# EAGLE design lego (EAGLE 5.06)
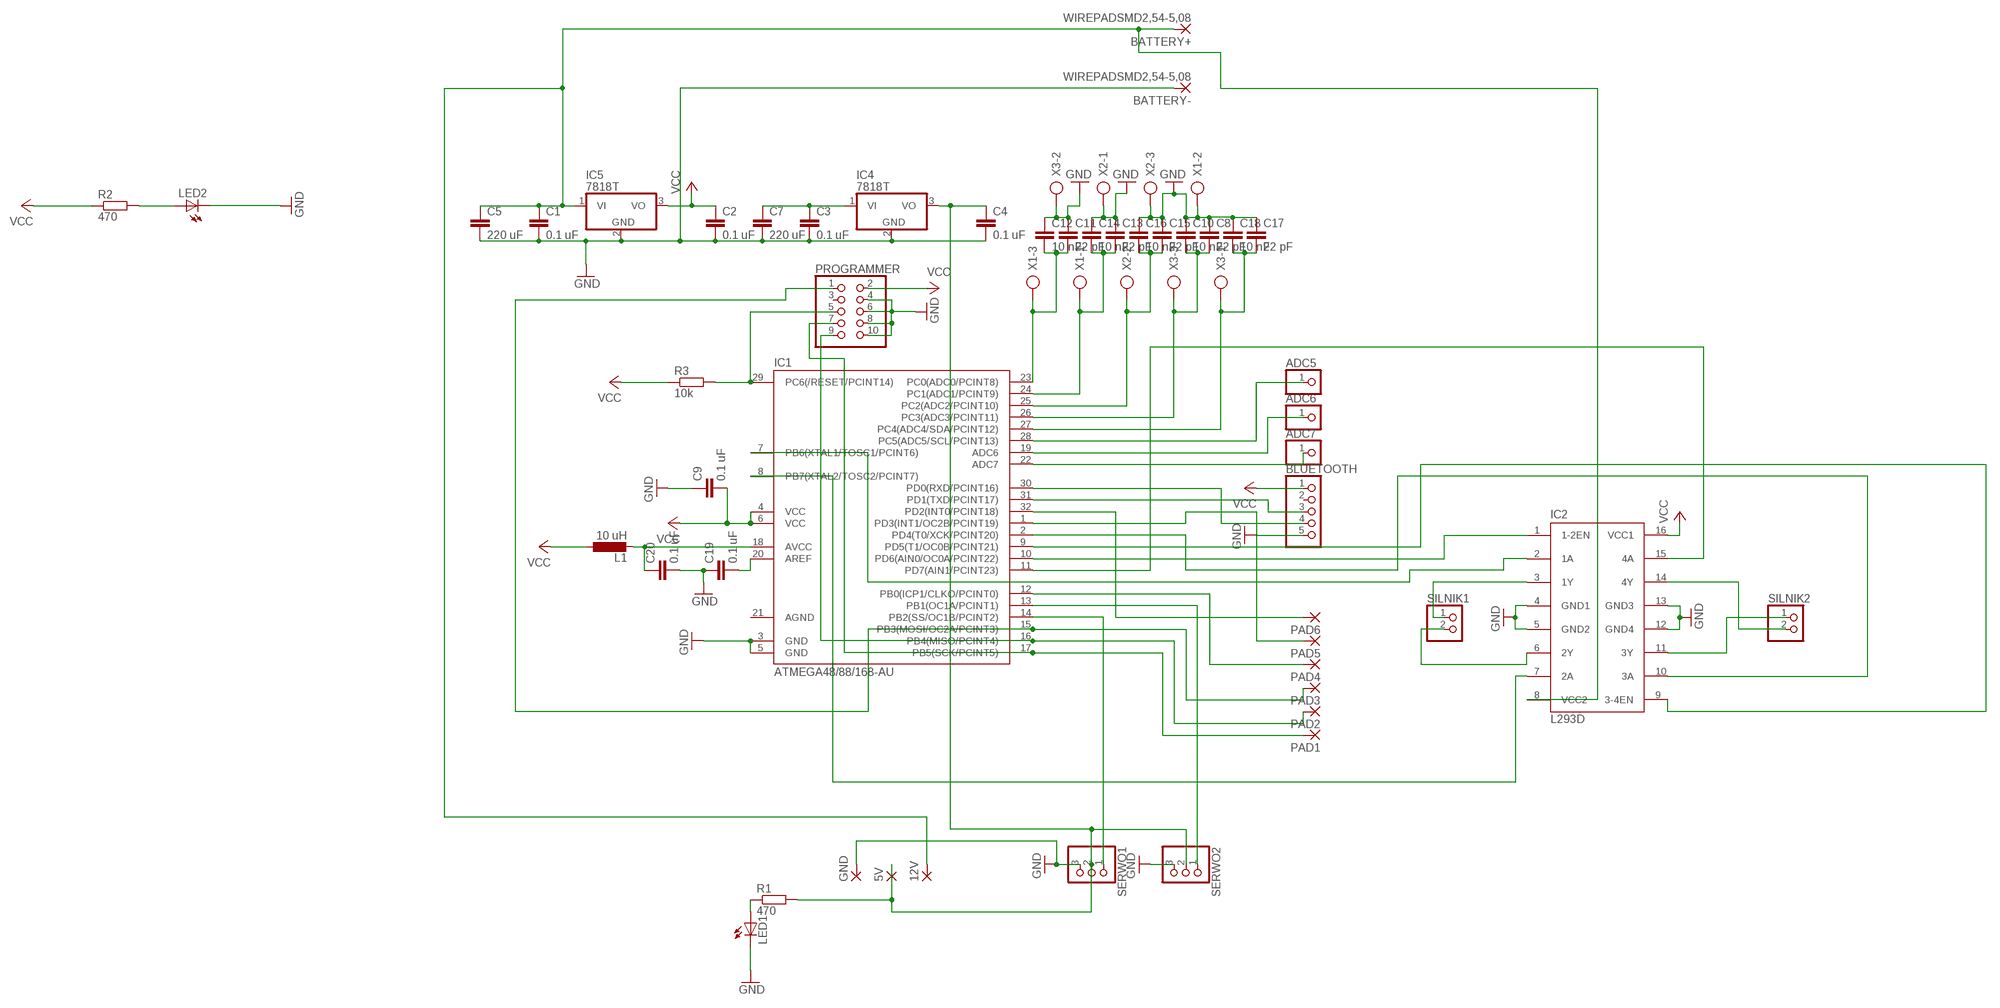
[diagram p0: schematic, sheet 1]

## Parts
5V  SMD2  [SMD1,27-2,54]
12V  SMD2  [SMD1,27-2,54]
ADC5  PINHD-1X1  [1X01]
ADC6  PINHD-1X1  [1X01]
ADC7  PINHD-1X1  [1X01]
BATTERY+  WIREPADSMD2,54-5,08  [SMD2,54-5,08]
BATTERY-  WIREPADSMD2,54-5,08  [SMD2,54-5,08]
BLUETOOTH  PINHD-1X5  [1X05]
C1  0.1 uF  C-EUC0805  [C0805]
C2  0.1 uF  C-EUC0805  [C0805]
C3  0.1 uF  C-EUC0805  [C0805]
C4  0.1 uF  C-EUC0805  [C0805]
C5  220 uF  C-EU025-050X050  [C025-050X050]
C7  220 uF  C-EU025-050X050  [C025-050X050]
C8  22 pF  C-EUC0805  [C0805]
C9  0.1 uF  C-EUC0805  [C0805]
C10  10 nF  C-EUC0805  [C0805]
C11  22 pF  C-EUC0805  [C0805]
C12  10 nF  C-EUC0805  [C0805]
C13  22 pF  C-EUC0805  [C0805]
C14  10 nF  C-EUC0805  [C0805]
C15  22 pF  C-EUC0805  [C0805]
C16  10 nF  C-EUC0805  [C0805]
C17  22 pF  C-EUC0805  [C0805]
C18  10 nF  C-EUC0805  [C0805]
C19  0.1 uF  C-EUC0805  [C0805]
C20  0.1 uF  C-EUC0805  [C0805]
GND  SMD2  [SMD1,27-2,54]
IC1  ATMEGA48/88/168-AU  [TQFP32-08]
IC2  L293D  [DIL16]
IC4  7818T  [TO220H]
IC5  7818T  [TO220H]
L1  10 uH  L-EU0207/7  [0207/7]
LED1  LED3MM  [LED3MM]
LED2  LED3MM  [LED3MM]
PAD1  SMD2  [SMD1,27-2,54]
PAD2  SMD2  [SMD1,27-2,54]
PAD3  SMD2  [SMD1,27-2,54]
PAD4  SMD2  [SMD1,27-2,54]
PAD5  SMD2  [SMD1,27-2,54]
PAD6  SMD2  [SMD1,27-2,54]
PROGRAMMER  PINHD-2X5  [2X05]
R1  470  R-EU_M0805  [M0805]
R2  470  R-EU_M0805  [M0805]
R3  10k  R-EU_M0805  [M0805]
SERWO1  PINHD-1X3  [1X03]
SERWO2  PINHD-1X3  [1X03]
SILNIK1  PINHD-1X2  [1X02]
SILNIK2  PINHD-1X2  [1X02]
X1  AK500/3  [AK500/3]
X2  AK500/3  [AK500/3]
X3  AK500/3  [AK500/3]

## Nets
GND: BATTERY-.1(P) BLUETOOTH.5 C1.2 C2.2 C3.2 C4.2 C5.2 C7.2 C8.1 C9.1 C10.1 C11.1 C12.1 C13.1 C14.1 C15.1 C16.1 C17.1 C18.1 C19.1 C20.2 GND.1(P) IC1.3(GND) IC1.5(GND) IC2.4(GND1) IC2.5(GND2) IC2.12(GND4) IC2.13(GND3) IC4.2(GND) IC5.2(GND) LED1.K(C) LED2.K(C) PROGRAMMER.4 PROGRAMMER.6 PROGRAMMER.8 PROGRAMMER.10 SERWO1.3 SERWO2.3 X1.2 X2.1 X2.3 X3.2
N$1: IC1.29(PC6(/RESET/PCINT14)) PROGRAMMER.5 R3.2
N$2: 12V.1(P) BATTERY+.1(P) C1.1 C5.1 IC2.8(VCC2) IC5.1(VI)
N$3: IC1.15(PB3(MOSI/OC2A/PCINT3)) PAD3.1(P) PROGRAMMER.1
N$4: C19.2 IC1.20(AREF)
N$5: C3.1 C7.1 IC4.1(VI)
N$6: C20.1 IC1.18(AVCC) L1.2
N$7: IC1.16(PB4(MISO/PCINT4)) PAD2.1(P) PROGRAMMER.9
N$8: IC1.17(PB5(SCK/PCINT5)) PAD1.1(P) PROGRAMMER.7
N$9: C11.2 C12.2 IC1.23(PC0(ADC0/PCINT8)) X1.3
N$10: C13.2 C14.2 IC1.24(PC1(ADC1/PCINT9)) X1.1
N$11: C15.2 C16.2 IC1.25(PC2(ADC2/PCINT10)) X2.2
N$12: C8.2 C10.2 IC1.26(PC3(ADC3/PCINT11)) X3.3
N$13: C17.2 C18.2 IC1.27(PC4(ADC4/SDA/PCINT12)) X3.1
N$14: ADC5.1 IC1.28(PC5(ADC5/SCL/PCINT13))
N$15: ADC6.1 IC1.19(ADC6)
N$16: ADC7.1 IC1.22(ADC7)
N$17: IC2.3(1Y) SILNIK1.1
N$18: IC2.11(3Y) SILNIK2.1
N$19: IC2.6(2Y) SILNIK1.2
N$20: IC2.14(4Y) SILNIK2.2
N$21: LED2.A R2.2
N$22: LED1.A R1.1
N$23: BLUETOOTH.4 IC1.30(PD0(RXD/PCINT16))
N$24: BLUETOOTH.3 IC1.31(PD1(TXD/PCINT17))
N$25: IC1.10(PD6(AIN0/OC0A/PCINT22)) IC2.1(1-2EN)
N$26: IC1.9(PD5(T1/OC0B/PCINT21)) IC2.9(3-4EN)
N$27: IC1.7(PB6(XTAL1/TOSC1/PCINT6)) IC2.2(1A)
N$28: IC1.8(PB7(XTAL2/TOSC2/PCINT7)) IC2.7(2A)
N$29: IC1.2(PD4(T0/XCK/PCINT20)) IC2.10(3A)
N$30: IC1.11(PD7(AIN1/PCINT23)) IC2.15(4A)
N$31: IC1.13(PB1(OC1A/PCINT1)) SERWO2.1
N$32: IC1.14(PB2(SS/OC1B/PCINT2)) SERWO1.1
N$33: 5V.1(P) C4.1 IC4.3(VO) R1.2 SERWO1.2 SERWO2.2
N$34: IC1.12(PB0(ICP1/CLKO/PCINT0)) PAD4.1(P)
N$35: IC1.1(PD3(INT1/OC2B/PCINT19)) PAD5.1(P)
N$36: IC1.32(PD2(INT0/PCINT18)) PAD6.1(P)
VCC: BLUETOOTH.1 C2.1 C9.2 IC1.4(VCC) IC1.6(VCC) IC2.16(VCC1) IC5.3(VO) L1.1 PROGRAMMER.2 R2.1 R3.1
Unconnected: BLUETOOTH.2 PROGRAMMER.3

## Power pins joined to a net without a drawn wire
AGND: IC1.21(AGND)

## Library data of the parts
5V 12V GND PAD1-PAD6 = wirepad:SMD2: SMD PAD
ADC5-ADC7 = pinhead:PINHD-1X1: PIN HEADER
BATTERY+ BATTERY- = wirepad:WIREPAD: Wire PAD connect wire on PCB
BLUETOOTH = pinhead:PINHD-1X5: PIN HEADER
C1-C5 C7-C20 = rcl:C-EU: CAPACITOR, European symbol
IC1 = atmega8:ATMEGA48/88/168
IC2 = st-microelectronics:L293D: PUSH-PULL 4 CHANNEL DRIVER
IC4 IC5 = linear:78*: Positive VOLTAGE REGULATOR Source: http://cache.national.com/ds/LM/LM78L05.pdf http://www.fairchildsemi.com/ds/LM/LM7805.pdf
L1 = rcl:L-EU: INDUCTOR, European symbol
LED1 LED2 = led:LED: LED OSRAM: - CHIPLED LG R971, LG N971, LY N971, LG Q971, LY Q971, LO R971, LY R971 LH N974, LH R974 LS Q976, LO Q976, LY Q976 LO Q996 - Hyper CHIPLED LW Q18S LB Q993, LB Q99A, LB R99A - SideLED LS A670, LO A670, LY A670, LG A670, LP A670 LB A673, LV A673, LT A673, LW A673 LH A674 LY A675 LS A676, LA A676, LO A676, LY A676, LW A676 LS A679, LY A679, LG A679 - Hyper Micro SIDELED® LS Y876, LA Y876, LO Y876, LY Y876 LT Y87S - SmartLED LW L88C, LW L88S LB L89C, LB L89S, LG L890 LS L89K, LO L89K, LY L89K LS L896, LA L896, LO L896, LY L896 - TOPLED LS T670, LO T670, LY T670, LG T670, LP T670 LSG T670, LSP T670, LSY T670, LOP T670, LYG T670 LG T671, LOG T671, LSG T671 LB T673, LV T673, LT T673, LW T673 LH T674 LS T676, LA T676, LO T676, LY T676, LB T676, LH T676, LSB T676, LW T676 LB T67C, LV T67C, LT T67C, LS T67K, LO T67K, LY T67K, LW E67C LS E67B, LA E67B, LO E67B, LY E67B, LB E67C, LV E67C, LT E67C LW T67C LS T679, LY T679, LG T679 LS T770, LO T770, LY T770, LG T770, LP T770 LB T773, LV T773, LT T773, LW T773 LH T774 LS E675, LA E675, LY E675, LS T675 LS T776, LA T776, LO T776, LY T776, LB T776 LHGB T686 LT T68C, LB T68C - Hyper Mini TOPLED® LB M676 - Mini TOPLED Santana® LG M470 LS M47K, LO M47K, LY M47K Source: http://www.osram.convergy.de LUXEON: - LUMILED® LXK2-PW12-R00, LXK2-PW12-S00, LXK2-PW14-U00, LXK2-PW14-V00 LXK2-PM12-R00, LXK2-PM12-S00, LXK2-PM14-U00 LXK2-PE12-Q00, LXK2-PE12-R00, LXK2-PE12-S00, LXK2-PE14-T00, LXK2-PE14-U00 LXK2-PB12-K00, LXK2-PB12-L00, LXK2-PB12-M00, LXK2-PB14-N00, LXK2-PB14-P00, LXK2-PB14-Q00 LXK2-PR12-L00, LXK2-PR12-M00, LXK2-PR14-Q00, LXK2-PR14-R00 LXK2-PD12-Q00, LXK2-PD12-R00, LXK2-PD12-S00 LXK2-PH12-R00, LXK2-PH12-S00 LXK2-PL12-P00, LXK2-PL12-Q00, LXK2-PL12-R00 Source: www.luxeon.com KINGBRIGHT: KA-3528ASYC Source: www.kingbright.com
PROGRAMMER = pinhead:PINHD-2X5: PIN HEADER
R1-R3 = rcl:R-EU_: RESISTOR, European symbol
SERWO1 SERWO2 = pinhead:PINHD-1X3: PIN HEADER
SILNIK1 SILNIK2 = pinhead:PINHD-1X2: PIN HEADER
X1-X3 = con-ptr500:AK500/3: CONNECTOR

## Board
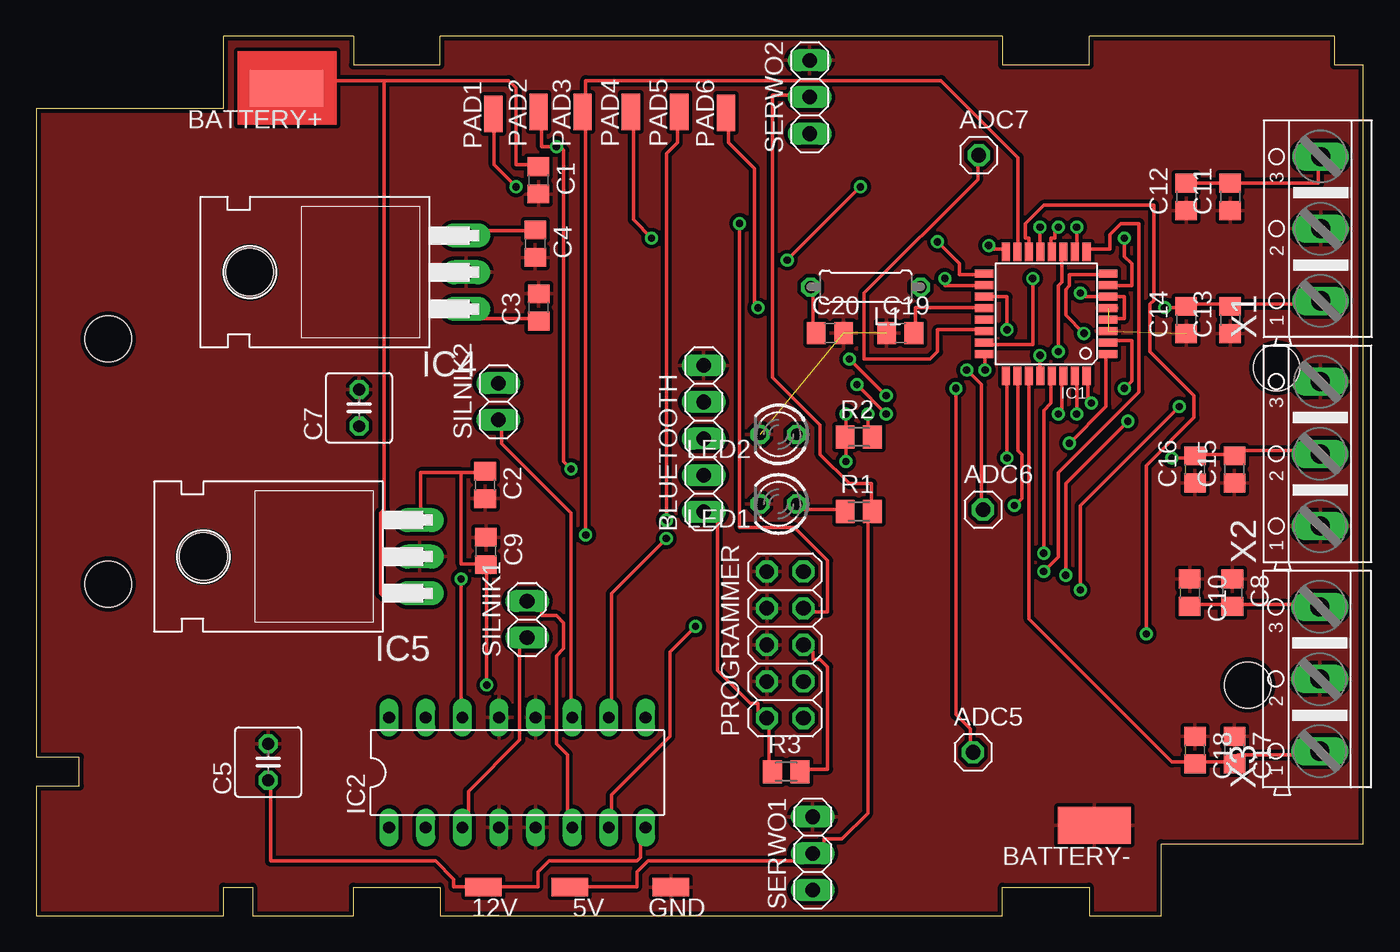
[diagram p1: board, top side]
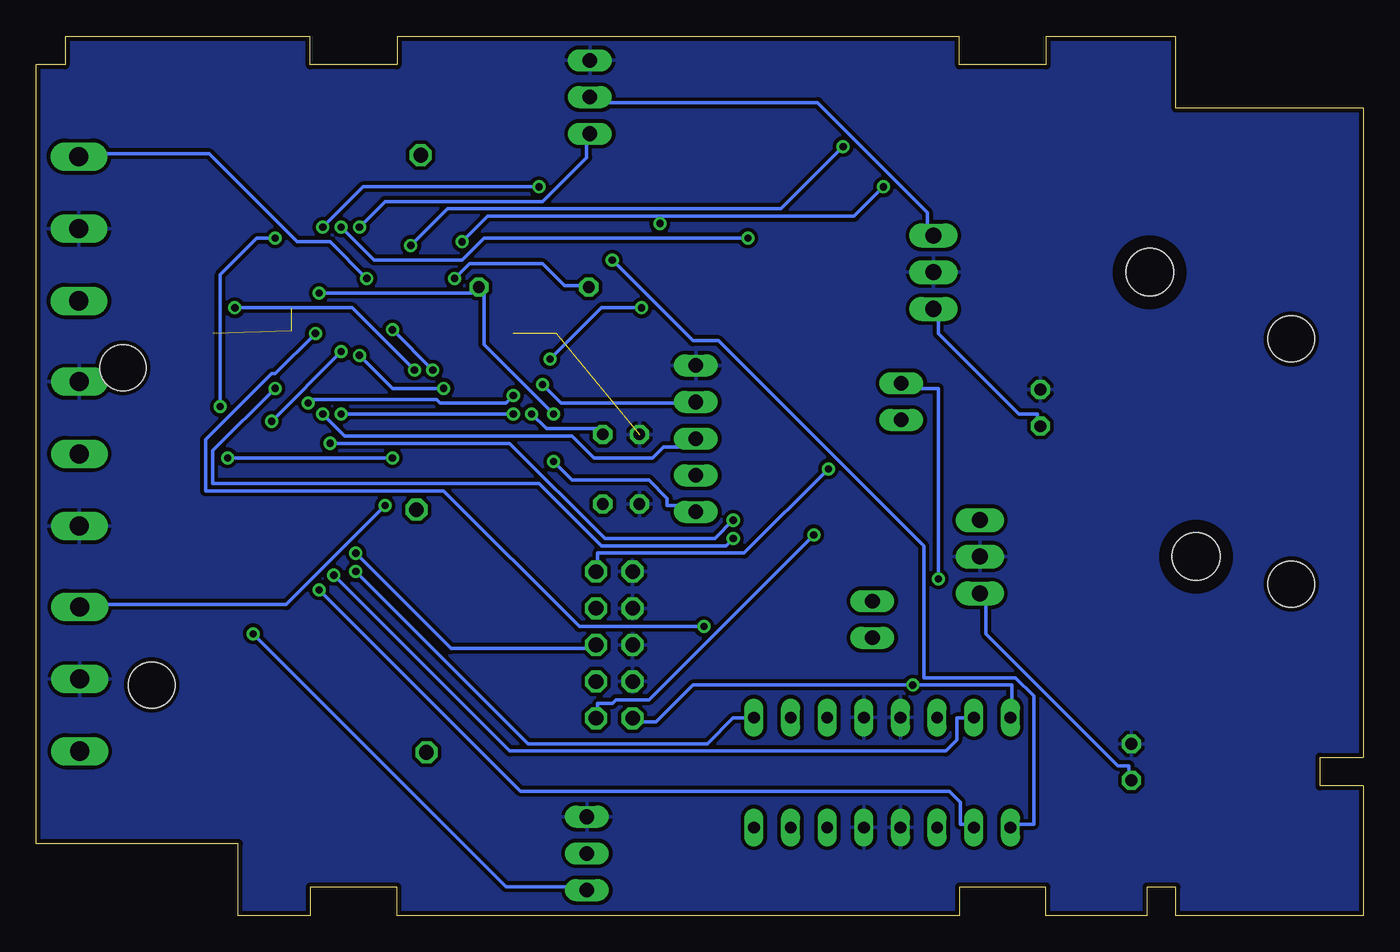
[diagram p2: board, bottom side, seen from below]

Size 92 x 61 mm. Coordinates in mm from the lower left corner, seen from the top.
Outline: 0,0 13,0 13,2 15,2 15,0 22,0 22,2 28,2 28,0 67,0 67,2 73,2 73,0 78,0 78,5 92,5 92,59 90,59 90,61 73,61 73,59 67,59 67,61 28,61 28,59 22,59 22,61 13,61 13,56 0,56 0,11 3,11 3,9 0,9 0,0
Copper layers (1*16): Top 0.035mm / dielectric 1.5mm / Bottom 0.035mm
Design rules "default *": minimum track width 10mil, minimum drill 0.5mm, track to track 10mil, track to pad 10mil, pad to pad 10mil, via to via 10mil, smd to smd 10mil, copper to edge 12mil, drill to drill 8mil, minimum pad ring 10mil, minimum via ring 8mil, stop-mask expansion 4mil, vias tented up to drill 0mil, thermal gap 10mil
Holes 3.2 mm at 5,23 5,40 84,16 86,38

### Footprints (pad centres in the part's own frame; a part is rotated, then mirrored left to right if it is on the bottom)
SMD1,27-2,54 = smd 1.27 x 2.54: 1 0,0
1X01 = drill 1.016 octagon: 1 0,0
SMD2,54-5,08 = smd 2.54 x 5.08: 1 0,0
1X05 = drill 1.016 long: 1 -5.08,0; 2 -2.54,0; 3 0,0; 4 2.54,0; 5 5.08,0
C0805 = smd 1.3 x 1.5: 1 -0.95,0; 2 0.95,0
C025-050X050 = drill 0.813 octagon: 1 -1.27,0; 2 1.27,0
TQFP32-08 = smd 1.27 x 0.559: 1 -4.293,2.8; 2 -4.293,2; 3 -4.293,1.2; 4 -4.293,0.4; 5 -4.293,-0.4; 6 -4.293,-1.2; 7 -4.293,-2; 8 -4.293,-2.8; 17 4.293,-2.8; 18 4.293,-2; 19 4.293,-1.2; 20 4.293,-0.4; 21 4.293,0.4; 22 4.293,1.2; 23 4.293,2; 24 4.293,2.8 | smd 0.559 x 1.27: 9 -2.8,-4.293; 10 -2,-4.293; 11 -1.2,-4.293; 12 -0.4,-4.293; 13 0.4,-4.293; 14 1.2,-4.293; 15 2,-4.293; 16 2.8,-4.293; 25 2.8,4.293; 26 2,4.293; 27 1.2,4.293; 28 0.4,4.293; 29 -0.4,4.293; 30 -1.2,4.293; 31 -2,4.293; 32 -2.8,4.293
DIL16 = drill 0.813 long: 1 -8.89,-3.81; 2 -6.35,-3.81; 3 -3.81,-3.81; 4 -1.27,-3.81; 5 1.27,-3.81; 6 3.81,-3.81; 7 6.35,-3.81; 8 8.89,-3.81; 9 8.89,3.81; 10 6.35,3.81; 11 3.81,3.81; 12 1.27,3.81; 13 -1.27,3.81; 14 -3.81,3.81; 15 -6.35,3.81; 16 -8.89,3.81
TO220H = drill 1.118 long: 1 -2.54,-10.16; 2 0,-10.16; 3 2.54,-10.16 | hole 3.302: 0,4.826
0207/7 = drill 0.813 octagon: 1 -3.81,0; 2 3.81,0
LED3MM = drill 0.813 octagon: A -1.27,0; K 1.27,0
2X05 = drill 1.016 octagon: 1 -5.08,-1.27; 2 -5.08,1.27; 3 -2.54,-1.27; 4 -2.54,1.27; 5 0,-1.27; 6 0,1.27; 7 2.54,-1.27; 8 2.54,1.27; 9 5.08,-1.27; 10 5.08,1.27
M0805 = smd 1.3 x 1.6: 1 -0.95,0; 2 0.95,0
1X03 = drill 1.016 long: 1 -2.54,0; 2 0,0; 3 2.54,0
1X02 = drill 1.016 long: 1 -1.27,0; 2 1.27,0
AK500/3 = drill 1.321 long: 1 -5.004,0; 2 0,0; 3 5.004,0

### Placement (x,y rotation side)
5V  37,2 90 top
12V  31,2 90 top
ADC5  64.95,11.34 0 top
ADC6  65.65,28.16 0 top
ADC7  65.34,52.74 0 top
BATTERY+  17.36,57.36 90 top
BATTERY-  73.36,6.28 90 top
BLUETOOTH  46.28,33.09 90 top
C1  34.82,51 270 top
C2  31.13,29.87 270 top
C3  34.84,42.18 90 top
C4  34.61,46.6 270 top
C5  16.09,10.66 90 top
C7  22.39,35.22 90 top
C8  82.92,22.41 270 top
C9  31.18,25.3 270 top
C10  79.97,22.41 270 top
C11  82.77,49.85 90 top
C12  79.72,49.85 90 top
C13  82.77,41.32 90 top
C14  79.72,41.32 90 top
C15  83.08,30.96 90 top
C16  80.33,30.96 90 top
C17  83.08,11.5 270 top
C18  80.33,11.5 270 top
C19  59.91,40.4 0 top
C20  55.04,40.4 0 top
GND  44,2 90 top
IC1  70.02,41.74 180 top
IC2  33.36,9.94 0 top
IC4  19.65,44.63 90 top
IC5  16.43,24.91 90 top
L1  57.51,43.6 180 top
LED1  51.46,28.56 180 top
LED2  51.46,33.38 180 top
PAD1  31.7,55.59 0 top
PAD2  34.83,55.73 0 top
PAD3  37.88,55.73 0 top
PAD4  41.23,55.73 0 top
PAD5  44.59,55.73 0 top
PAD6  47.83,55.67 0 top
PROGRAMMER  51.93,18.79 90 top
R1  57.03,28.03 0 top
R2  57.03,33.2 0 top
R3  52,10 0 top
SERWO1  53.83,4.33 90 top
SERWO2  53.63,56.77 90 top
SILNIK1  34.04,20.55 90 top
SILNIK2  32.04,35.66 90 top
X1  89.04,47.65 90 top
X2  89.01,32.04 90 top
X3  88.99,16.43 90 top

### Tracks (layer width: path | path; a pad name or v marks a point on that pad's centre or on a via)
GND  (4 unrouted)
  pour Bottom: 0,0 0,9 3,9 3,11 0,11 0,56 13,56 13,61 22,61 22,59 28,59 28,61 67,61 67,59 73,59 73,61 90,61 90,59 92,59 92,5 78,5 78,0 73,0 73,2 67,2 67,0 28,0 28,2 22,2 22,0 15,0 15,2 13,2 13,0
  pour Top: 0,0 0,9 3,9 3,11 0,11 0,56 13,56 13,61 22,61 22,59 28,59 28,61 67,61 67,59 73,59 73,61 90,61 90,59 92,59 92,5 78,5 78,0 73,0 73,2 67,2 67,0 28,0 28,2 22,2 22,0 15,0 15,2 13,2 13,0
N$1  (via drill 0.5)
  Top 0.254: v69.85,25.15 69.85,35.05 70.36,35.56 70.36,37.34 IC1.29 | R3.2 53.09,10.16 54.86,10.16 54.86,17.27 54.36,17.78 53.85,17.78 53.85,18.29 53.34,18.8 PROGRAMMER.5
  Bottom 0.254: v69.85,25.15 63.25,18.54 53.34,18.54 PROGRAMMER.5
N$2
  Top 0.254: 24.13,57.91 17.53,57.91 17.53,57.4 BATTERY+.1 | 24.13,57.91 32.77,57.91 33.27,57.4 33.27,52.07 34.8,52.07 C1.1 | IC2.8 42.16,6.1 41.91,5.84 41.91,4.06 41.66,3.81 35.56,3.81 34.8,3.05 34.8,2.03 31.24,2.03 12V.1 30.99,2.03 28.96,2.03 28.96,2.54 27.69,3.81 16.26,3.81 16.26,9.14 C5.1 | 24.13,57.91 24.13,28.19 23.88,27.94 23.88,22.35 24.13,22.1 26.42,22.1 26.42,22.35 IC5.1
  Bottom 0.254: C5.1 16.26,9.4 16.26,10.41 17.02,10.41 26.16,19.56 26.16,22.35 26.42,22.35 IC5.1
N$3  (via drill 0.5)
  Top 0.254: IC1.15 68.07,46.23 68.07,52.58 62.74,57.91 38.1,57.91 38.1,55.88 PAD3.1 38.1,55.63 v38.1,26.42
  Bottom 0.254: v38.1,26.42 49.53,14.99 51.82,14.99 52.07,14.73 53.09,14.73 53.09,13.72 PROGRAMMER.1
N$4
  Top 0.254: IC1.20 65.53,42.16 60.96,42.16 60.96,40.64 C19.2
N$5
  Top 0.254: C3.1 34.8,41.4 29.97,41.4 29.97,41.91 IC4.1
  Bottom 0.254: C7.1 22.61,34.04 22.61,34.8 23.88,34.8 29.46,40.39 29.46,41.91 29.72,41.91 IC4.1
N$6  (via drill 0.5)
  Top 0.254: v62.99,44.2 62.99,43.69 65.53,43.69 IC1.18 | C20.1 53.85,40.64 53.85,43.43 L1.2
  Bottom 0.254: v62.99,44.2 61.98,45.21 56.9,45.21 55.37,43.69 53.85,43.69 L1.2
N$7  (via drill 0.5)
  Top 0.254: v66.04,46.48 66.04,46.23 67.06,46.23 IC1.16 | PAD2.1 35.05,55.63 35.05,53.34 v36.07,53.34 36.32,53.34 36.58,53.09 36.58,31.5 v37.08,30.99
  Bottom 0.254: v66.04,46.48 63.5,49.02 40.39,49.02 v36.07,53.34 | v37.08,30.99 42.93,25.15 53.09,25.15 53.09,23.88 PROGRAMMER.9
N$8  (via drill 0.5)
  Top 0.254: v62.48,46.74 64.01,45.21 64.01,44.45 65.53,44.45 IC1.17 | v33.27,50.55 31.75,52.07 31.75,55.37 PAD1.1 | v48.77,48.01 48.77,26.92 52.58,26.92 54.86,24.64 54.86,21.08 53.34,21.08 PROGRAMMER.7
  Bottom 0.254: v62.48,46.74 60.71,48.51 48.77,48.51 | 48.77,48.51 35.31,48.51 v33.27,50.55 | v48.77,48.01 48.77,48.51
N$9  (via drill 0.5)
  Top 0.254: C12.2 79.76,50.8 82.55,50.8 C11.2 82.8,50.8 88.9,50.8 88.9,52.58 X1.3 | v69.09,44.2 69.09,39.62 65.79,39.62 IC1.23
  Bottom 0.254: v69.09,44.2 71.63,46.74 73.91,46.74 80.01,52.83 88.9,52.83 X1.3
N$10  (via drill 0.5)
  Top 0.254: v65.79,37.85 65.79,38.86 IC1.24 | v78.23,42.16 79.5,42.16 C14.2 79.76,42.42 82.55,42.42 C13.2 82.8,42.42 88.9,42.42 X1.1
  Bottom 0.254: v65.79,37.85 70.1,42.16 v78.23,42.16
N$11  (via drill 0.5)
  Top 0.254: v67.31,31.75 67.31,37.34 IC1.25 | v78.74,31.75 80.26,31.75 C16.2 80.52,32 83.06,32 C15.2 83.31,32 83.31,32.26 88.9,32.26 X2.2
  Bottom 0.254: v67.31,31.75 v78.74,31.75
N$12  (via drill 0.5)
  Top 0.254: C10.2 80.01,21.59 82.8,21.59 C8.2 83.06,21.59 88.9,21.59 X3.3 | v67.82,28.45 68.33,28.96 68.33,32 68.07,32.26 68.07,37.34 IC1.26
  Bottom 0.254: v67.82,28.45 74.68,21.59 88.9,21.59 X3.3
N$13
  Top 0.254: IC1.27 68.83,37.34 68.83,20.57 78.74,10.67 80.26,10.67 C18.2 80.52,10.67 83.06,10.67 C17.2 83.31,10.67 83.31,11.18 88.9,11.18 X3.1
N$14  (via drill 0.5)
  Top 0.254: v69.6,38.86 69.6,37.59 IC1.28 | v63.75,36.58 63.75,13.97 64.77,12.95 64.77,11.43 ADC5.1
  Bottom 0.254: v69.6,38.86 67.31,36.58 v63.75,36.58
N$15  (via drill 0.5)
  Top 0.254: v67.31,40.64 67.31,42.93 65.79,42.93 IC1.19 | v64.52,37.85 65.53,36.83 65.53,28.19 ADC6.1
  Bottom 0.254: v64.52,37.85 v67.31,40.64
N$16
  Top 0.254: IC1.22 65.53,40.64 62.48,40.64 62.48,39.12 61.98,38.61 57.4,38.61 57.4,43.18 65.28,51.05 65.28,52.58 ADC7.1
N$17
  Top 0.254: IC2.3 29.72,6.35 29.97,6.6 29.97,8.64 33.53,12.19 33.53,18.54 34.04,19.05 SILNIK1.1
N$18
  Top 0.254: IC2.11 37.08,13.97 37.08,27.94 32.26,32.77 32.26,34.29 SILNIK2.1
N$19
  Top 0.254: IC2.6 37.08,6.35 36.83,6.6 36.83,11.18 36.07,11.94 36.07,18.03 36.58,18.54 36.58,20.32 36.07,20.83 35.05,20.83 35.05,21.08 34.29,21.84 SILNIK1.2
N$20  (via drill 0.5)
  Top 0.254: v29.46,23.37 29.46,13.97 IC2.14
  Bottom 0.254: v29.46,23.37 29.46,36.58 31.75,36.58 32,36.83 SILNIK2.2
N$21  (via drill 0.5)
  Top 0.254: v57.66,34.8 57.66,33.53 R2.2
  Bottom 0.254: v57.66,34.8 56.64,33.78 52.83,33.78 52.58,33.53 LED2.A
N$22
  Top 0.254: R1.1 55.88,28.19 52.83,28.19 52.83,28.45 LED1.A
N$23  (via drill 0.5)
  Top 0.254: v70.87,34.8 71.12,35.05 71.12,37.34 IC1.30 | v56.9,36.83 v58.93,34.8
  Bottom 0.254: v58.93,34.8 v70.87,34.8 | v56.9,36.83 55.63,35.56 46.48,35.56 BLUETOOTH.4
N$24  (via drill 0.5)
  Top 0.254: v72.14,34.8 72.14,37.34 IC1.31
  Bottom 0.254: v72.14,34.8 70.61,33.27 54.86,33.27 53.34,31.75 49.28,31.75 48.51,32.51 46.99,32.51 46.48,33.02 BLUETOOTH.3
N$25  (via drill 0.5)
  Top 0.254: v72.14,47.75 72.14,46.23 IC1.10 | v52.07,45.47 v57.15,50.55
  Bottom 0.254: v72.14,47.75 69.34,50.55 v57.15,50.55 | v52.07,45.47 46.48,39.88 44.7,39.88 30.48,25.65 30.48,16.51 24.13,16.51 22.86,15.24 22.86,6.35 24.38,6.35 IC2.1
N$26  (via drill 0.5)
  Top 0.254: v69.85,23.88 70.87,24.89 70.87,30.73 76.45,36.32 76.45,48.01 75.18,48.01 74.42,47.24 74.42,46.23 72.9,46.23 IC1.9
  Bottom 0.254: v69.85,23.88 57.91,11.94 45.47,11.94 43.69,13.72 42.42,13.72 IC2.9
N$27  (via drill 0.5)
  Top 0.254: v75.44,46.99 75.44,45.72 75.95,45.21 75.95,43.69 74.42,43.69 IC1.7 | v79.25,35.31 72.39,28.45 v72.39,22.61
  Bottom 0.254: v75.44,46.99 76.71,46.99 79.25,44.45 v79.25,35.31 | v72.39,22.61 58.42,8.64 28.7,8.64 27.94,7.87 27.94,6.35 27.18,6.35 IC2.2
N$28  (via drill 0.5)
  Top 0.254: v72.64,40.39 71.37,41.66 71.37,43.43 71.63,43.69 71.63,44.45 74.17,44.45 IC1.8 | v45.72,20.07 43.94,18.29 43.94,12.45 39.88,8.38 39.88,6.35 IC2.7
  Bottom 0.254: v72.64,40.39 75.44,37.59 75.69,37.59 80.26,33.02 80.26,29.46 63.75,29.46 54.36,20.07 v45.72,20.07
N$29  (via drill 0.5)
  Top 0.254: v75.44,36.58 75.95,37.08 75.95,39.88 74.42,39.88 IC1.2 | v43.69,26.16 39.88,22.35 39.88,13.97 IC2.10
  Bottom 0.254: v75.44,36.58 79.76,32.26 79.76,29.97 57.15,29.97 52.83,25.65 44.2,25.65 v43.69,26.16
N$30  (via drill 0.5)
  Top 0.254: v70.87,39.12 70.87,43.69 71.12,43.94 71.12,45.97 IC1.11 | v75.69,34.29 71.37,29.97 v71.37,23.62
  Bottom 0.254: v75.69,34.29 v70.87,39.12 | v71.37,23.62 59.18,11.43 28.96,11.43 28.19,12.19 28.19,13.72 27.18,13.72 IC2.15
N$31  (via drill 0.5)
  Top 0.254: v69.6,47.75 69.6,46.23 IC1.13
  Bottom 0.254: v69.6,47.75 67.82,49.53 56.9,49.53 53.85,52.58 53.85,54.1 SERWO2.1
N$32  (via drill 0.5)
  Top 0.254: v76.96,19.56 76.96,31.24 80.26,34.54 80.26,36.07 77.22,39.12 77.22,42.42 77.47,42.67 77.47,49.28 69.85,49.28 68.58,48.01 68.58,46.99 68.83,46.99 68.83,46.23 IC1.14
  Bottom 0.254: v76.96,19.56 59.44,2.03 53.85,2.03 SERWO1.1
N$33
  Top 0.254: C4.1 34.54,47.5 29.97,47.5 29.97,47.24 IC4.3 | 5V.1 37.08,2.03 41.66,2.03 41.66,3.05 42.42,3.81 53.59,3.81 53.59,4.32 SERWO1.2 53.85,4.32 54.61,5.08 54.61,5.33 55.88,5.33 57.66,7.11 57.66,27.69 57.91,27.94 R1.2 57.91,28.19 57.91,29.97 56.39,29.97 54.36,32 54.36,34.04 51.05,37.34 51.05,56.9 53.59,56.9 SERWO2.2
  Bottom 0.254: SERWO2.2 53.59,56.64 53.34,56.39 37.85,56.39 30.23,48.77 30.23,47.24 29.97,47.24 IC4.3
N$34  (via drill 0.5)
  Top 0.254: v70.87,47.75 70.61,47.5 70.61,46.99 70.36,46.99 70.36,46.23 IC1.12 | v42.67,46.99 41.4,48.26 41.4,55.63 PAD4.1
  Bottom 0.254: v70.87,47.75 68.58,45.47 62.48,45.47 60.96,46.99 v42.67,46.99
N$35  (via drill 0.5)
  Top 0.254: v71.63,32.77 74.17,35.31 74.17,38.86 IC1.1 | v43.69,27.43 43.69,52.83 44.45,53.59 44.45,55.63 PAD5.1
  Bottom 0.254: v71.63,32.77 59.18,32.77 52.58,26.16 44.96,26.16 v43.69,27.43
N$36  (via drill 0.5)
  Top 0.254: v73.15,35.56 72.9,35.81 72.9,37.34 IC1.32 | v56.39,38.61 v58.93,36.07 | v50.04,42.16 49.78,42.42 49.78,51.82 48.01,53.59 48.01,55.63 PAD6.1
  Bottom 0.254: v73.15,35.56 72.9,35.81 64.26,35.81 64.01,35.56 59.44,35.56 v58.93,36.07 | v56.39,38.61 52.83,42.16 v50.04,42.16
VCC  (via drill 0.5)
  Top 0.254: IC1.4 74.42,41.4 75.44,41.4 75.44,42.93 74.42,42.93 IC1.6 74.17,42.93 72.39,42.93 v72.39,43.18 | v56.13,34.8 56.13,33.27 R2.1 56.13,33.02 v56.13,31.5 | 29.46,30.73 26.67,30.73 26.67,27.69 IC5.3 | 29.46,30.73 30.99,30.73 C2.1 | 29.46,30.73 29.46,24.38 30.99,24.38 C9.2 31.24,24.13 v31.24,16 | R3.1 50.8,10.16 50.8,13.46 PROGRAMMER.2 50.55,13.72 50.04,14.22 50.04,14.73 49.53,14.73 47.24,17.02 47.24,27.94 46.48,27.94 BLUETOOTH.1
  Bottom 0.254: v56.13,34.8 60.96,39.62 60.96,43.18 | 60.96,43.18 60.96,43.43 61.21,43.43 L1.1 60.96,43.18 | 60.96,43.18 v72.39,43.18 | IC2.16 24.38,13.97 24.38,16 v31.24,16 46.48,16 49.02,13.46 50.55,13.46 PROGRAMMER.2 | v56.13,31.5 54.86,30.23 49.53,30.23 48.26,28.96 48.26,28.45 46.74,28.45 46.48,28.19 BLUETOOTH.1
(copper drawn outside any net)
  shapes: Top area x1